# EasyEDA Pro project HNDX.eprj, board PCB8
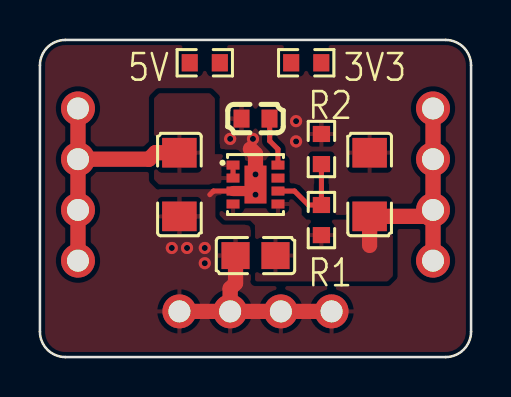
[diagram p11: board, top side]
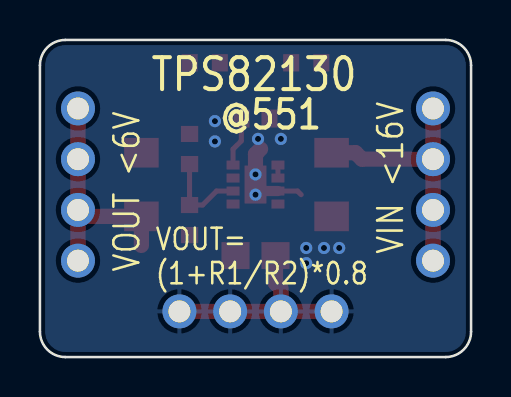
[diagram p12: board, bottom side, seen from below]

Outline 21.59 x 15.88 mm; copper layers: Top Layer, Bottom Layer. Coordinates in mm from the lower left corner of the outline.
Outline path: 0,14.6 0,1.27 arc(0.37,0.37) 1.27,0 20.32,0 arc(21.22,0.37) 21.59,1.27 21.59,14.6 arc(21.22,15.5) 20.32,15.88 1.27,15.88 arc(0.37,15.5) 0,14.6
Stack: Top Layer 0.035mm / Dielectric1 1.51mm FR4 er 4.5 / Bottom Layer 0.035mm

## Design rules (mm)
template: JLCPCB Capability(Two Layers Board)
spacing copperThickness1oz (default): track to track 0.102, other pairs 0.152 to 0.3
spacing copperThickness2oz: track to track 0.203, other pairs 0.152 to 0.3
track width copperThickness1oz (default): min 0.127, default 0.254, max 2.54
track width copperThickness2oz: min 0.203, default 0.254, max 2.54
differential pair differentialPair (default): width min 0.127, default 0.254, max 2.54; gap min 0.152, default 0.152
via viaSize (default): diameter min 0.5, default 0.61, max 10; hole min 0.3, default 0.305, max 6.3

## Placement (name value [footprint] x y rotation side)
C1  10uF  [C1206]  6.98 8.64 90 top
C2  22uF  [C0805]  10.79 5.08 0 top
C3  3.3nF  [C0603]  10.79 11.94 180 top
C4  10uF  [C1206]  16.51 8.64 270 top
H1  PZ254V-11-04P  [HDR-TH_4P-P2.54-V-M]  19.68 8.64 90 top
H6  PZ254V-11-04P  [HDR-TH_4P-P2.54-V-M]  1.91 8.64 270 top
H7  PZ254V-11-04P  [HDR-TH_4P-P2.54-V-M]  10.79 2.29 0 top
R1  100kΩ  [R0603]  14.1 6.86 270 top
R2  100kΩ  [R0603]  14.1 10.41 270 top
R3  100kΩ  [R0603]  8.25 14.73 180 top
R4  100kΩ  [R0603]  13.33 14.73 180 top
U1  TPS82130SILR  [USIP-8_L3.0-W2.8-P0.65-TL-EP]  10.79 8.64 0 top

## Footprints (pads in the part's own frame, mm; a bottom-side part is the same pattern mirrored in y, then rotated)
C0603
  rect 0.8x0.9 smd: 1(-0.7,0) 2(0.7,0)
C0805
  rect 1.41x1.35 smd: 1(-1,0) 2(1,0)
C1206
  rect 1.485x1.728 smd: 1(-1.593,0) 2(1.593,0)
HDR-TH_4P-P2.54-V-M
  round 1.7 hole 1.1: 1(-3.81,0) 2(-1.27,0) 3(1.27,0) 4(3.81,0)
R0603
  rect 0.806x0.864 smd: 1(-0.753,0) 2(0.753,0)
USIP-8_L3.0-W2.8-P0.65-TL-EP
  rect 0.65x0.45 smd: 1(-1.125,0.975) 2(-1.125,0.325) 3(-1.125,-0.325) 4(-1.125,-0.975) 5(1.125,-0.975) 6(1.125,-0.325) 7(1.125,0.325) 8(1.125,0.975)
  rect 1.1x1.9 smd: 9(0,0)

## Nets
As in the schematic.

Pads without a net: R3 1 2; R4 1 2; U1 7

## Via types
v1: diameter 0.61, hole 0.305, Top Layer to Bottom Layer, 10 vias

## Routing (per net, layer and track width the routed paths; a pad name or vN(x,y) marks a point on that pad's centre or on a via; arc(x,y) is an arc through that point)
GND: length 14.9
  Top Layer w0.254: U1.3 8.69,8.31 8.51,8.13
  Top Layer w0.508: U1.3 10.47,8.31 U1.9
  Top Layer w0.762: C2.1 9.79,3.7 9.52,3.43 H7.2 ; 10.54,10.41 10.79,10.16 v1(10.79,9.14) U1.9 ; H7.2 H7.3 H7.4 ; H7.2 H7.1
  vias: v1(6.6,5.46) v1(7.37,5.46) v1(8.25,5.46) v1(8.25,4.7) v1(9.52,10.92) v1(10.67,10.92) v1(10.79,8.13) v1(12.83,11.81) v1(12.83,10.8)
VIN: length 13.5
  Top Layer w0.254: U1.2 U1.1
  Top Layer w0.762: H6.4 H6.3 H6.2 ; H6.1 H6.2 ; H6.2 5.46,9.91 5.78,10.23 C1.2
VOUT: length 12.4
  Top Layer w0.762: 16.51,5.59 C4.2 19.36,7.04 H1.2 ; H1.4 H1.3 H1.2 ; H1.2 H1.1
$1N329: length 4.5
  Top Layer w0.254: R2.2 R1.1 13.44,7.61 12.75,8.31 U1.6
$1N675: length 2.5
  Top Layer w0.254: U1.8 11.92,10.41 11.51,10.82 11.51,11.93 C3.1

## Copper pours and planes (outline as drawn; the poured copper is in the pictures)
GND on Top Layer: 0,16 21.84,16 21.84,-0.13 0,-0.13
GND on Top Layer: 10.54,3.81 10.54,6.35 10.29,6.6 9.02,6.6 8.76,6.86 8.76,8.13 10.54,8.13 11.05,8.64 11.05,12.7 12.57,12.7 12.57,8.89 12.83,8.64 15.11,8.64 15.11,12.95 14.86,13.21 9.27,13.21 9.02,12.95 9.02,10.67 9.27,10.41 10.03,10.41 10.29,10.16 10.29,8.64 10.03,8.38 5.97,8.38 5.71,8.13 5.71,4.06 5.97,3.81
GND on Bottom Layer: -1.78,17.53 23.62,17.53 23.62,-1.65 -1.78,-1.65
VIN on Top Layer: 5.71,8.89 5.97,8.64 10.03,8.64 10.03,9.91 9.78,10.16 8.76,10.16 8.76,12.95 8.51,13.21 5.97,13.21 5.71,12.95
VOUT on Top Layer: 12.83,7.87 9.02,7.87 9.02,7.11 9.27,6.86 10.54,6.86 10.79,6.6 10.79,3.81 17.4,3.81 17.65,4.06 17.65,6.6 17.4,6.86 13.33,6.86 13.08,7.11 13.08,7.62

## Text on the board
Bottom Silkscreen Layer: VOUT= / (1+R1/R2)*0.8 | VIN <16V | VOUT <6V | @551 | TPS82130
Document Layer: VOUT=(1+R1/R2)*0.8 | 电容耐压值要合适 | 最大输入电压16V，最大输出电压6V | 最上面0603封装焊盘用于标记 / 无电路中实际作用 | 信息与警告：
Top Silkscreen Layer: 5V | 3V3 | R2 | R1
